# Altium schematic sheet CT9042 FrontPanel draft.SchDoc
size Tabloid; SheetNumber: 2; SheetTotal: 10
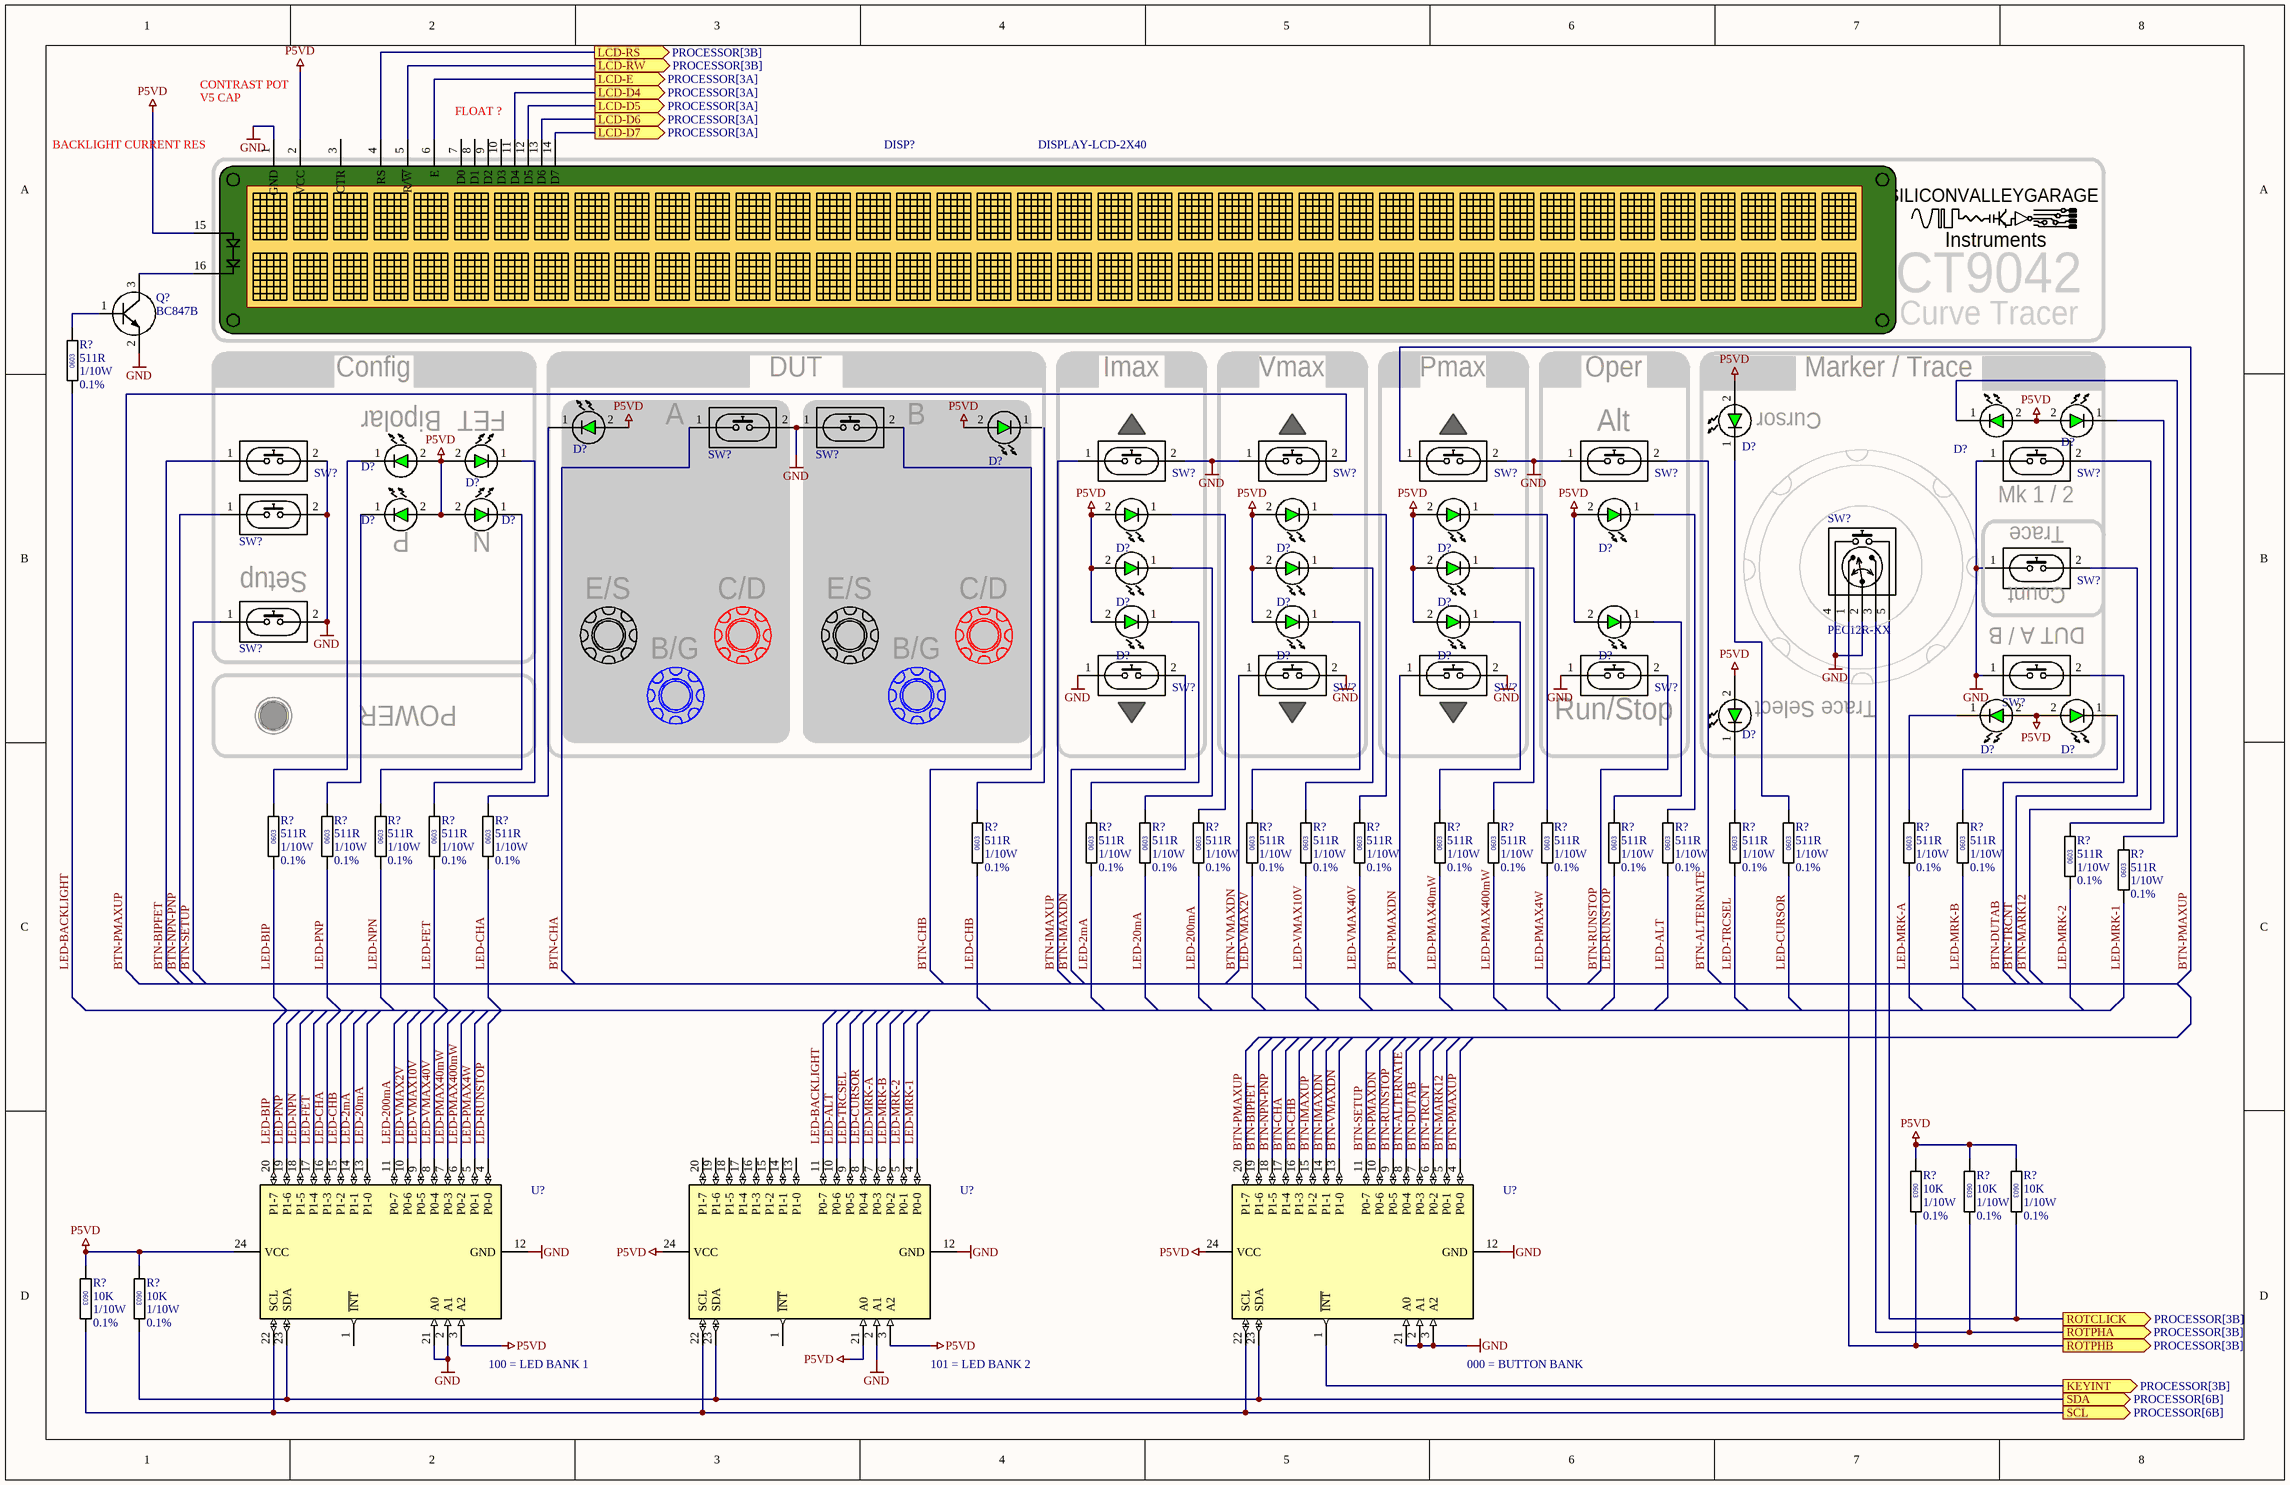
[diagram p0: CT9042 FrontPanel draft.SchDoc]

## Parts
(Parts that share a designator on the sheet are numbered #1, #2 ... from top to bottom, then left to right.)
D?#1  LED-3MM-GREEN  [LED-3MM-GREEN]  (value not drawn)
D?#2  LED-3MM-GREEN  [LED-3MM-GREEN]  (value not drawn)
D?#3  LED-3MM-GREEN  [LED-3MM-GREEN]  (value not drawn)
D?#4  LED-3MM-GREEN  [LED-3MM-GREEN]  (value not drawn)
D?#5  LED-3MM-GREEN  [LED-3MM-GREEN]  (value not drawn)
D?#6  LED-3MM-GREEN  [LED-3MM-GREEN]  (value not drawn)
D?#7  LED-3MM-GREEN  [LED-3MM-GREEN]  (value not drawn)
D?#8  LED-3MM-GREEN  [LED-3MM-GREEN]  (value not drawn)
D?#9  LED-3MM-GREEN  [LED-3MM-GREEN]  (value not drawn)
D?#10  LED-3MM-GREEN  [LED-3MM-GREEN]  (value not drawn)
D?#11  LED-3MM-GREEN  [LED-3MM-GREEN]  (value not drawn)
D?#12  LED-3MM-GREEN  [LED-3MM-GREEN]  (value not drawn)
D?#13  LED-3MM-GREEN  [LED-3MM-GREEN]  (value not drawn)
D?#14  LED-3MM-GREEN  [LED-3MM-GREEN]  (value not drawn)
D?#15  LED-3MM-GREEN  [LED-3MM-GREEN]  (value not drawn)
D?#16  LED-3MM-GREEN  [LED-3MM-GREEN]  (value not drawn)
D?#17  LED-3MM-GREEN  [LED-3MM-GREEN]  (value not drawn)
D?#18  LED-3MM-GREEN  [LED-3MM-GREEN]  (value not drawn)
D?#19  LED-3MM-GREEN  [LED-3MM-GREEN]  (value not drawn)
D?#20  LED-3MM-GREEN  [LED-3MM-GREEN]  (value not drawn)
D?#21  LED-3MM-GREEN  [LED-3MM-GREEN]  (value not drawn)
D?#22  LED-3MM-GREEN  [LED-3MM-GREEN]  (value not drawn)
D?#23  LED-3MM-GREEN  [LED-3MM-GREEN]  (value not drawn)
DISP?  DISPLAY-LCD-2X40
LOGO?  LOGO-SILICONVALLEYGARAGE-SMALL  [SILICONVALLEYGARAGE]  (value not drawn)  (graphical)
Q?  BC847B  [SOT23]
R?#1  value 511R  Power: 1/10W  Tolerance: 0.1%  [RESC0603]  (hidden comment: RESC0603)
R?#2  value 511R  Power: 1/10W  Tolerance: 0.1%  [RESC0603]  (hidden comment: RESC0603)
R?#3  value 511R  Power: 1/10W  Tolerance: 0.1%  [RESC0603]  (hidden comment: RESC0603)
R?#4  value 511R  Power: 1/10W  Tolerance: 0.1%  [RESC0603]  (hidden comment: RESC0603)
R?#5  value 511R  Power: 1/10W  Tolerance: 0.1%  [RESC0603]  (hidden comment: RESC0603)
R?#6  value 511R  Power: 1/10W  Tolerance: 0.1%  [RESC0603]  (hidden comment: RESC0603)
R?#7  value 511R  Power: 1/10W  Tolerance: 0.1%  [RESC0603]  (hidden comment: RESC0603)
R?#8  value 511R  Power: 1/10W  Tolerance: 0.1%  [RESC0603]  (hidden comment: RESC0603)
R?#9  value 511R  Power: 1/10W  Tolerance: 0.1%  [RESC0603]  (hidden comment: RESC0603)
R?#10  value 511R  Power: 1/10W  Tolerance: 0.1%  [RESC0603]  (hidden comment: RESC0603)
R?#11  value 511R  Power: 1/10W  Tolerance: 0.1%  [RESC0603]  (hidden comment: RESC0603)
R?#12  value 511R  Power: 1/10W  Tolerance: 0.1%  [RESC0603]  (hidden comment: RESC0603)
R?#13  value 511R  Power: 1/10W  Tolerance: 0.1%  [RESC0603]  (hidden comment: RESC0603)
R?#14  value 511R  Power: 1/10W  Tolerance: 0.1%  [RESC0603]  (hidden comment: RESC0603)
R?#15  value 511R  Power: 1/10W  Tolerance: 0.1%  [RESC0603]  (hidden comment: RESC0603)
R?#16  value 511R  Power: 1/10W  Tolerance: 0.1%  [RESC0603]  (hidden comment: RESC0603)
R?#17  value 511R  Power: 1/10W  Tolerance: 0.1%  [RESC0603]  (hidden comment: RESC0603)
R?#18  value 511R  Power: 1/10W  Tolerance: 0.1%  [RESC0603]  (hidden comment: RESC0603)
R?#19  value 511R  Power: 1/10W  Tolerance: 0.1%  [RESC0603]  (hidden comment: RESC0603)
R?#20  value 511R  Power: 1/10W  Tolerance: 0.1%  [RESC0603]  (hidden comment: RESC0603)
R?#21  value 511R  Power: 1/10W  Tolerance: 0.1%  [RESC0603]  (hidden comment: RESC0603)
R?#22  value 511R  Power: 1/10W  Tolerance: 0.1%  [RESC0603]  (hidden comment: RESC0603)
R?#23  value 511R  Power: 1/10W  Tolerance: 0.1%  [RESC0603]  (hidden comment: RESC0603)
R?#24  value 511R  Power: 1/10W  Tolerance: 0.1%  [RESC0603]  (hidden comment: RESC0603)
R?#25  value 10K  Power: 1/10W  Tolerance: 0.1%  [RESC0603]  (hidden comment: RESC0603)
R?#26  value 10K  Power: 1/10W  Tolerance: 0.1%  [RESC0603]  (hidden comment: RESC0603)
R?#27  value 10K  Power: 1/10W  Tolerance: 0.1%  [RESC0603]  (hidden comment: RESC0603)
R?#28  value 10K  Power: 1/10W  Tolerance: 0.1%  [RESC0603]  (hidden comment: RESC0603)
R?#29  value 10K  Power: 1/10W  Tolerance: 0.1%  [RESC0603]  (hidden comment: RESC0603)
SW?#1  320.04  (value not drawn)
SW?#2  320.04  (value not drawn)
SW?#3  320.04  (value not drawn)
SW?#4  320.04  (value not drawn)
SW?#5  320.04  (value not drawn)
SW?#6  320.04  (value not drawn)
SW?#7  320.04  (value not drawn)
SW?#8  320.04  (value not drawn)
SW?#9  320.04  (value not drawn)
SW?#10  PEC12R-XX
SW?#11  320.04  (value not drawn)
SW?#12  320.04  (value not drawn)
SW?#13  320.04  (value not drawn)
SW?#14  320.04  (value not drawn)
SW?#15  320.04  (value not drawn)
SW?#16  320.04  (value not drawn)
SW?#17  320.04  (value not drawn)
U?#1  PCAL9555  (value not drawn)
U?#2  PCAL9555  (value not drawn)
U?#3  PCAL9555  (value not drawn)

## Blocks framed on the sheet
CT9042: DISP? LOGO?
Imax: D?#10 D?#14 D?#17 SW?#4 SW?#13
Vmax: D?#11 D?#15 D?#18 SW?#5 SW?#14
Pmax: D?#12 D?#16 D?#19 SW?#6 SW?#15
Marker / Trace: D?#1 D?#2 D?#7 D?#21-D?#23 SW?#8 SW?#10 SW?#11 SW?#17

## Ports
KEYINT (out, see PROCESSOR[3B]), LCD-D4 (out, see PROCESSOR[3A]), LCD-D5 (out, see PROCESSOR[3A]), LCD-D6 (out, see PROCESSOR[3A]), LCD-D7 (out, see PROCESSOR[3A]), LCD-E (out, see PROCESSOR[3A]), LCD-RS (out, see PROCESSOR[3B]), LCD-RW (out, see PROCESSOR[3B]), ROTCLICK (out, see PROCESSOR[3B]), ROTPHA (out, see PROCESSOR[3B]), ROTPHB (out, see PROCESSOR[3B]), SCL (out, see PROCESSOR[6B]), SDA (out, see PROCESSOR[6B])

## Nets
GND: DISP?.1(GND) Q?.2(E) SW?#1.2 SW?#2.1 SW?#3.2 SW?#4.2 SW?#5.1 SW?#6.2 SW?#7.1 SW?#8.1 SW?#9.2 SW?#10.2 SW?#10.4 SW?#11.1 SW?#12.2 SW?#13.1 SW?#14.2 SW?#15.2 SW?#16.1 SW?#17.1 U?#1.2(A1) U?#1.12(GND) U?#1.21(A0) U?#2.2(A1) U?#2.12(GND) U?#3.2(A1) U?#3.3(A2) U?#3.12(GND) U?#3.21(A0)
P5VD: D?#1.2(K) D?#2.2(K) D?#3.2(K) D?#4.2(K) D?#5.2(K) D?#6.2(K) D?#7.2(K) D?#8.2(K) D?#9.2(K) D?#10.2(K) D?#11.2(K) D?#12.2(K) D?#13.2(K) D?#14.2(K) D?#15.2(K) D?#16.2(K) D?#17.2(K) D?#18.2(K) D?#19.2(K) D?#20.2(K) D?#21.2(K) D?#22.2(K) D?#23.2(K) DISP?.2(VCC) DISP?.15(LED+) R?#25.2 R?#26.2 R?#27.2 R?#28.2 R?#29.2 U?#1.3(A2) U?#1.24(VCC) U?#2.3(A2) U?#2.21(A0) U?#2.24(VCC) U?#3.24(VCC)
BTN-ALTERNATE: SW?#7.2 U?#3.8(P0-4)
BTN-BIPFET: SW?#3.1 U?#3.19(P1-6)
BTN-CHA: SW?#1.1 U?#3.17(P1-4)
BTN-CHB: SW?#2.2 U?#3.16(P1-3)
BTN-DUTAB: SW?#17.2 U?#3.7(P0-3)
BTN-IMAXDN: SW?#13.2 U?#3.14(P1-1)
BTN-IMAXUP: SW?#4.1 U?#3.15(P1-2)
BTN-MARK12: SW?#8.2 U?#3.5(P0-1)
BTN-NPN-PNP: SW?#9.1 U?#3.18(P1-5)
BTN-PMAXDN: SW?#15.1 U?#3.10(P0-6)
BTN-PMAXUP: SW?#5.2 SW?#6.1 U?#3.4(P0-0) U?#3.20(P1-7)
BTN-RUNSTOP: SW?#16.2 U?#3.9(P0-5)
BTN-SETUP: SW?#12.1 U?#3.11(P0-7)
BTN-TRCNT: SW?#11.2 U?#3.6(P0-2)
BTN-VMAXDN: SW?#14.1 U?#3.13(P1-0)
KEYINT: U?#3.1(~{INT}) ; port KEYINT
LCD-D4: DISP?.11(D4) ; port LCD-D4
LCD-D5: DISP?.12(D5) ; port LCD-D5
LCD-D6: DISP?.13(D6) ; port LCD-D6
LCD-D7: DISP?.14(D7) ; port LCD-D7
LCD-E: DISP?.6(E) ; port LCD-E
LCD-RS: DISP?.4(RS) ; port LCD-RS
LCD-RW: DISP?.5(R/~{W}) ; port LCD-RW
LED-2mA: R?#8.2 U?#1.14(P1-1)
LED-20mA: R?#9.2 U?#1.13(P1-0)
LED-200mA: R?#10.2 U?#1.11(P0-7)
LED-ALT: R?#18.2 U?#2.10(P0-6)
LED-BACKLIGHT: R?#1.2 U?#2.11(P0-7)
LED-BIP: R?#2.2 U?#1.20(P1-7)
LED-CHA: R?#6.2 U?#1.16(P1-3)
LED-CHB: R?#7.2 U?#1.15(P1-2)
LED-CURSOR: R?#20.2 U?#2.8(P0-4)
LED-FET: R?#5.2 U?#1.17(P1-4)
LED-MRK-1: R?#24.2 U?#2.4(P0-0)
LED-MRK-2: R?#23.2 U?#2.5(P0-1)
LED-MRK-A: R?#21.2 U?#2.7(P0-3)
LED-MRK-B: R?#22.2 U?#2.6(P0-2)
LED-NPN: R?#4.2 U?#1.18(P1-5)
LED-PMAX4W: R?#16.2 U?#1.5(P0-1)
LED-PMAX40mW: R?#14.2 U?#1.7(P0-3)
LED-PMAX400mW: R?#15.2 U?#1.6(P0-2)
LED-PNP: R?#3.2 U?#1.19(P1-6)
LED-RUNSTOP: R?#17.2 U?#1.4(P0-0)
LED-TRCSEL: R?#19.2 U?#2.9(P0-5)
LED-VMAX2V: R?#11.2 U?#1.10(P0-6)
LED-VMAX10V: R?#12.2 U?#1.9(P0-5)
LED-VMAX40V: R?#13.2 U?#1.8(P0-4)
ROTCLICK: R?#27.1 SW?#10.5 ; port ROTCLICK
ROTPHA: R?#26.1 SW?#10.3 ; port ROTPHA
ROTPHB: R?#25.1 SW?#10.1 ; port ROTPHB
SCL: R?#28.1 U?#1.22(SCL) U?#2.22(SCL) U?#3.22(SCL) ; port SCL
SDA: R?#29.1 U?#1.23(SDA) U?#2.23(SDA) U?#3.23(SDA) ; port SDA
NetD?#1_1: D?#1.1(A) R?#24.1
NetD?#2_1: D?#2.1(A) R?#23.1
NetD?#3_1: D?#3.1(A) R?#6.1
NetD?#4_1: D?#4.1(A) R?#7.1
NetD?#5_1: D?#5.1(A) R?#2.1
NetD?#6_1: D?#6.1(A) R?#5.1
NetD?#7_1: D?#7.1(A) R?#20.1
NetD?#8_1: D?#8.1(A) R?#3.1
NetD?#9_1: D?#9.1(A) R?#4.1
NetD?#10_1: D?#10.1(A) R?#10.1
NetD?#11_1: D?#11.1(A) R?#13.1
NetD?#12_1: D?#12.1(A) R?#16.1
NetD?#13_1: D?#13.1(A) R?#18.1
NetD?#14_1: D?#14.1(A) R?#9.1
NetD?#15_1: D?#15.1(A) R?#12.1
NetD?#16_1: D?#16.1(A) R?#15.1
NetD?#17_1: D?#17.1(A) R?#8.1
NetD?#18_1: D?#18.1(A) R?#11.1
NetD?#19_1: D?#19.1(A) R?#14.1
NetD?#20_1: D?#20.1(A) R?#17.1
NetD?#21_1: D?#21.1(A) R?#21.1
NetD?#22_1: D?#22.1(A) R?#22.1
NetD?#23_1: D?#23.1(A) R?#19.1
NetDISP?_16: DISP?.16(LED-) Q?.3(C)
NetQ?_1: Q?.1(B) R?#1.1

Not connected (* = marked no-connect by the designer): DISP? 3(CTR) 7(D0) 8(D1) 9(D2) 10(D3); U?#1 1(~{INT}); U?#2 1(~{INT}) 13(P1-0) 14(P1-1) 15(P1-2) 16(P1-3) 17(P1-4) 18(P1-5) 19(P1-6) 20(P1-7)

## Notes on the sheet
- CONTRAST POT
- (near DISP?) BACKLIGHT CURRENT RES
- V5 CAP
- (near DISP?) FLOAT ?
- (near LOGO?) Instruments
- Config
- (near SW?#2) DUT
- Oper
- Curve Tracer
- (near D?#5) Bipolar
- (near D?#6) FET
- (near SW?#1) A
- (near SW?#2) B
- (near SW?#7) Alt
- (near D?#7) Cursor
- (near SW?#8) Mk 1 / 2
- (near D?#8) P
- (near D?#9) N
- (near SW?#11) Trace
- (near SW?#12) Setup
- E/S
- C/D
- (near SW?#17) DUT A / B
- (near SW?#11) Count
- B/G
- (near SW?#16) Run/Stop
- (near D?#23) Trace Select
- POWER
- (near U?#1) 100 = LED BANK 1
- (near U?#2) 101 = LED BANK 2
- (near U?#3) 000 = BUTTON BANK
- (in symbol LOGO-SILICONVALLEYGARAGE-SMALL) SILICONVALLEYGARAGE
- (in symbol RESC-0603-10K-0.1%-1/10W) 0603
- (in symbol RESC-0603-511R-0.1%-1/10W) 0603

## Library data of the parts
D?#1-D?#23 = LED-3MM-GREEN: LED,TH,GREEN,42mCd,3MM; Manufacturer 1: WURTH; Manufacturer Part Number 1: 151031VS06000; MOUSER: 78-VLMPG33N1P2; Supplier 1: Mouser; Supplier Part Number 1: 78-VLMPG33N1P2
DISP? = DISPLAY-LCD-2X40: DISPLAY,LCD,ALPHA,2X40CHAR,HD44780,YELLOW BL
LOGO? = LOGO-SILICONVALLEYGARAGE-SMALL: LOGO,SILICONVALLEYGARAGE,SMALL
Q? = XSTR-NPN-BC847: XSTR,NPN,45V,0.1A,,BC847B,SOT23
R?#1-R?#24 = RESC-0603-511R-0.1%-1/10W: RESISTOR,511R,0.1%,100mW,0603 (1608); Location: *
R?#25-R?#29 = RESC-0603-10K-0.1%-1/10W: RESISTOR,10K,0.1%,100mW,0603 (1608); Location: *
SW?#1-SW?#9 SW?#11-SW?#17 = SWITCH-E-SWITCH-320.04: SW,SMD,TACT,2PIN,OBLONG CAP,GREY; Manufacturer Part Number 1: 320.04E11GRYVERT; DIGIKEY: EG5799-ND; Manufacturer 1: E-SWITCH
SW?#10 = SWITCH-BOURNS-PEC12R
U?#1-U?#3 = IC-NEXPERIA-PCAL9555A: I2C,16BIT AGILE I/O EXPANDER,INT,NEXPERIA,PCAL95555,TSSOP24; Manufacturer Part Number 1: PCAL9555APW,118; DIGIKEY: 568-9928-1-ND; Manufacturer 1: NEXPERIA